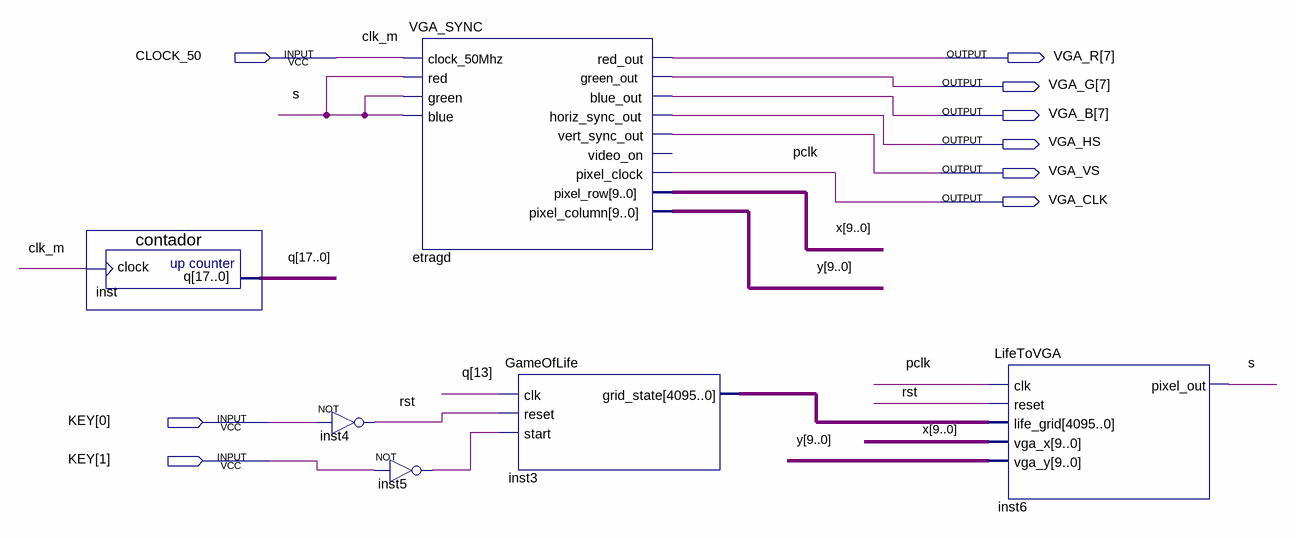
[diagram p0: schematic sheet]
// Quartus schematic JogodaVida.bdf as structural Verilog: 6 symbols, 9 pins
module JogodaVida (
  input  CLOCK_50,
  input  [1:0] KEY,
  output [7:7] VGA_R,
  output [7:7] VGA_G,
  output [7:7] VGA_B,
  output VGA_HS,
  output VGA_VS,
  output VGA_CLK
);

  wire inst5_out, rst, s;
  wire [9:0] x, y;
  wire [17:0] q;
  wire [4095:0] inst3_grid_state;

  contador inst (.clock(CLOCK_50), .q(q));
  not inst4 (rst, KEY[0]);
  not inst5 (inst5_out, KEY[1]);
  VGA_SYNC etragd (
    .clock_50Mhz(CLOCK_50), .red(s), .green(s), .blue(s), .red_out(VGA_R[7]), .green_out(VGA_G[7]),
    .blue_out(VGA_B[7]), .horiz_sync_out(VGA_HS), .vert_sync_out(VGA_VS), .pixel_clock(VGA_CLK),
    .pixel_row(x), .pixel_column(y));  // open: video_on
  GameOfLife inst3 (.clk(q[13]), .reset(rst), .start(inst5_out), .grid_state(inst3_grid_state));
  LifeToVGA inst6 (.clk(VGA_CLK), .reset(rst), .life_grid(inst3_grid_state), .vga_x(x), .vga_y(y), .pixel_out(s));

  // Other names for the same wires on the sheet: clk_m = CLOCK_50; pclk = VGA_CLK
endmodule
